# Altium schematic sheet MillingLight.SchDoc
size A3
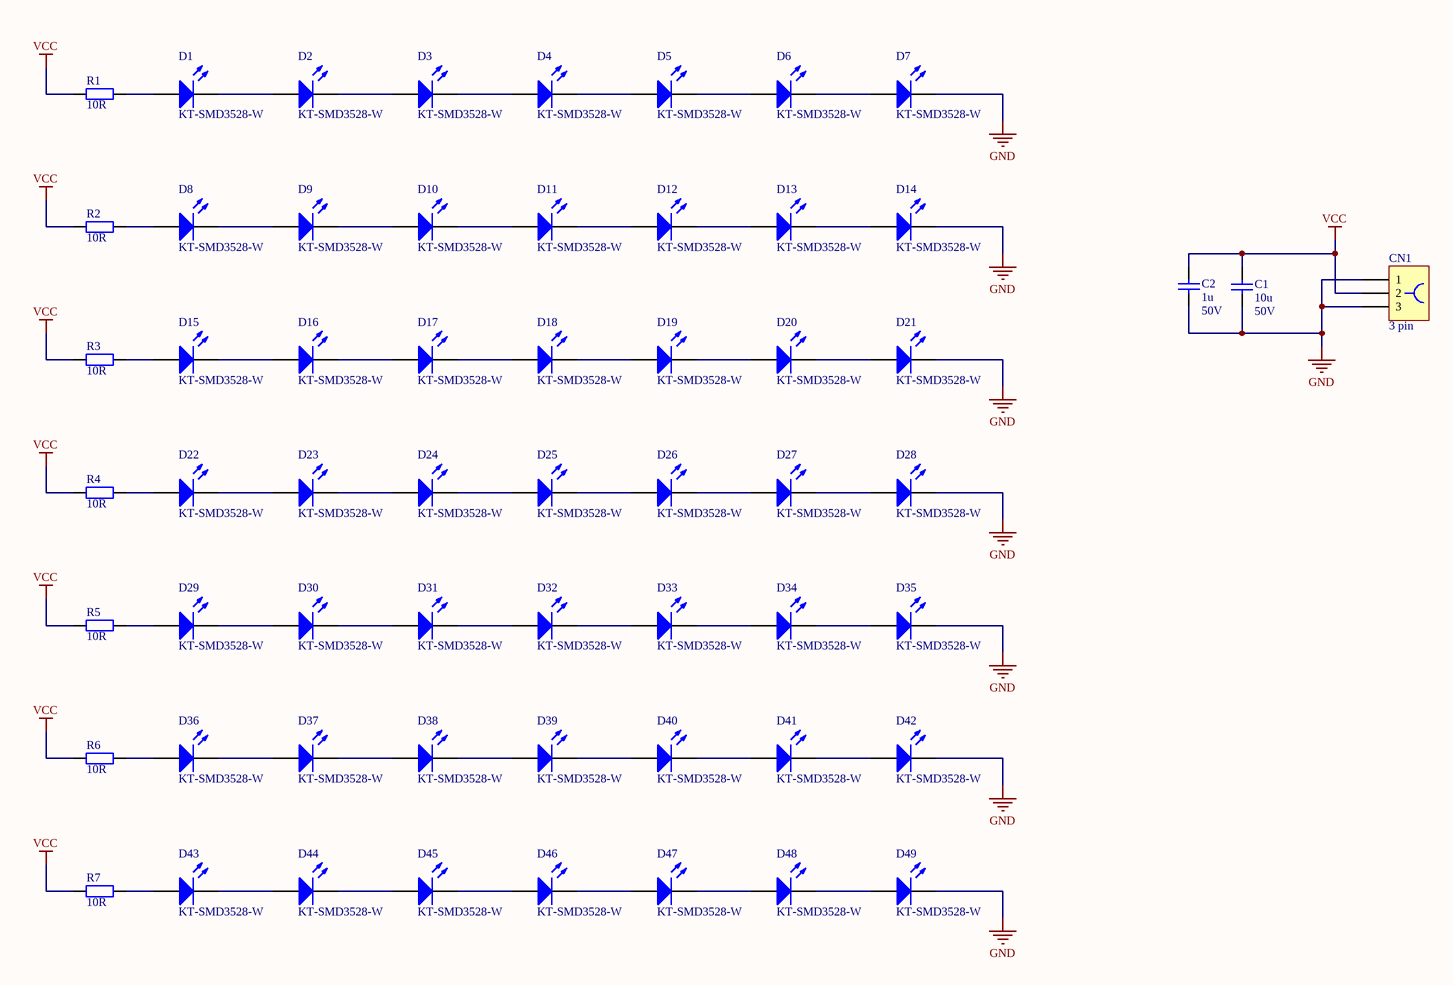
[diagram p0: MillingLight.SchDoc]

## Parts
C1  Value1: 10u  Value2: 50V  [CAPC3216X18N]  (hidden comment: CAP)
C2  Value1: 1u  Value2: 50V  [CAPC2012X125N]  (hidden comment: CAP)
CN1  Value1: 3 pin  [CN_WURTH_691216510003]  (hidden comment: CN_1X3F)
D1  Value1: KT-SMD3528-W  [DIO_Kento_KT-SMD3528-W]  (hidden comment: DIO_LED)
D2  Value1: KT-SMD3528-W  [DIO_Kento_KT-SMD3528-W]  (hidden comment: DIO_LED)
D3  Value1: KT-SMD3528-W  [DIO_Kento_KT-SMD3528-W]  (hidden comment: DIO_LED)
D4  Value1: KT-SMD3528-W  [DIO_Kento_KT-SMD3528-W]  (hidden comment: DIO_LED)
D5  Value1: KT-SMD3528-W  [DIO_Kento_KT-SMD3528-W]  (hidden comment: DIO_LED)
D6  Value1: KT-SMD3528-W  [DIO_Kento_KT-SMD3528-W]  (hidden comment: DIO_LED)
D7  Value1: KT-SMD3528-W  [DIO_Kento_KT-SMD3528-W]  (hidden comment: DIO_LED)
D8  Value1: KT-SMD3528-W  [DIO_Kento_KT-SMD3528-W]  (hidden comment: DIO_LED)
D9  Value1: KT-SMD3528-W  [DIO_Kento_KT-SMD3528-W]  (hidden comment: DIO_LED)
D10  Value1: KT-SMD3528-W  [DIO_Kento_KT-SMD3528-W]  (hidden comment: DIO_LED)
D11  Value1: KT-SMD3528-W  [DIO_Kento_KT-SMD3528-W]  (hidden comment: DIO_LED)
D12  Value1: KT-SMD3528-W  [DIO_Kento_KT-SMD3528-W]  (hidden comment: DIO_LED)
D13  Value1: KT-SMD3528-W  [DIO_Kento_KT-SMD3528-W]  (hidden comment: DIO_LED)
D14  Value1: KT-SMD3528-W  [DIO_Kento_KT-SMD3528-W]  (hidden comment: DIO_LED)
D15  Value1: KT-SMD3528-W  [DIO_Kento_KT-SMD3528-W]  (hidden comment: DIO_LED)
D16  Value1: KT-SMD3528-W  [DIO_Kento_KT-SMD3528-W]  (hidden comment: DIO_LED)
D17  Value1: KT-SMD3528-W  [DIO_Kento_KT-SMD3528-W]  (hidden comment: DIO_LED)
D18  Value1: KT-SMD3528-W  [DIO_Kento_KT-SMD3528-W]  (hidden comment: DIO_LED)
D19  Value1: KT-SMD3528-W  [DIO_Kento_KT-SMD3528-W]  (hidden comment: DIO_LED)
D20  Value1: KT-SMD3528-W  [DIO_Kento_KT-SMD3528-W]  (hidden comment: DIO_LED)
D21  Value1: KT-SMD3528-W  [DIO_Kento_KT-SMD3528-W]  (hidden comment: DIO_LED)
D22  Value1: KT-SMD3528-W  [DIO_Kento_KT-SMD3528-W]  (hidden comment: DIO_LED)
D23  Value1: KT-SMD3528-W  [DIO_Kento_KT-SMD3528-W]  (hidden comment: DIO_LED)
D24  Value1: KT-SMD3528-W  [DIO_Kento_KT-SMD3528-W]  (hidden comment: DIO_LED)
D25  Value1: KT-SMD3528-W  [DIO_Kento_KT-SMD3528-W]  (hidden comment: DIO_LED)
D26  Value1: KT-SMD3528-W  [DIO_Kento_KT-SMD3528-W]  (hidden comment: DIO_LED)
D27  Value1: KT-SMD3528-W  [DIO_Kento_KT-SMD3528-W]  (hidden comment: DIO_LED)
D28  Value1: KT-SMD3528-W  [DIO_Kento_KT-SMD3528-W]  (hidden comment: DIO_LED)
D29  Value1: KT-SMD3528-W  [DIO_Kento_KT-SMD3528-W]  (hidden comment: DIO_LED)
D30  Value1: KT-SMD3528-W  [DIO_Kento_KT-SMD3528-W]  (hidden comment: DIO_LED)
D31  Value1: KT-SMD3528-W  [DIO_Kento_KT-SMD3528-W]  (hidden comment: DIO_LED)
D32  Value1: KT-SMD3528-W  [DIO_Kento_KT-SMD3528-W]  (hidden comment: DIO_LED)
D33  Value1: KT-SMD3528-W  [DIO_Kento_KT-SMD3528-W]  (hidden comment: DIO_LED)
D34  Value1: KT-SMD3528-W  [DIO_Kento_KT-SMD3528-W]  (hidden comment: DIO_LED)
D35  Value1: KT-SMD3528-W  [DIO_Kento_KT-SMD3528-W]  (hidden comment: DIO_LED)
D36  Value1: KT-SMD3528-W  [DIO_Kento_KT-SMD3528-W]  (hidden comment: DIO_LED)
D37  Value1: KT-SMD3528-W  [DIO_Kento_KT-SMD3528-W]  (hidden comment: DIO_LED)
D38  Value1: KT-SMD3528-W  [DIO_Kento_KT-SMD3528-W]  (hidden comment: DIO_LED)
D39  Value1: KT-SMD3528-W  [DIO_Kento_KT-SMD3528-W]  (hidden comment: DIO_LED)
D40  Value1: KT-SMD3528-W  [DIO_Kento_KT-SMD3528-W]  (hidden comment: DIO_LED)
D41  Value1: KT-SMD3528-W  [DIO_Kento_KT-SMD3528-W]  (hidden comment: DIO_LED)
D42  Value1: KT-SMD3528-W  [DIO_Kento_KT-SMD3528-W]  (hidden comment: DIO_LED)
D43  Value1: KT-SMD3528-W  [DIO_Kento_KT-SMD3528-W]  (hidden comment: DIO_LED)
D44  Value1: KT-SMD3528-W  [DIO_Kento_KT-SMD3528-W]  (hidden comment: DIO_LED)
D45  Value1: KT-SMD3528-W  [DIO_Kento_KT-SMD3528-W]  (hidden comment: DIO_LED)
D46  Value1: KT-SMD3528-W  [DIO_Kento_KT-SMD3528-W]  (hidden comment: DIO_LED)
D47  Value1: KT-SMD3528-W  [DIO_Kento_KT-SMD3528-W]  (hidden comment: DIO_LED)
D48  Value1: KT-SMD3528-W  [DIO_Kento_KT-SMD3528-W]  (hidden comment: DIO_LED)
D49  Value1: KT-SMD3528-W  [DIO_Kento_KT-SMD3528-W]  (hidden comment: DIO_LED)
R1  Value1: 10R  [RESC2012X60N]  (hidden comment: RES)
R2  Value1: 10R  [RESC2012X60N]  (hidden comment: RES)
R3  Value1: 10R  [RESC2012X60N]  (hidden comment: RES)
R4  Value1: 10R  [RESC2012X60N]  (hidden comment: RES)
R5  Value1: 10R  [RESC2012X60N]  (hidden comment: RES)
R6  Value1: 10R  [RESC2012X60N]  (hidden comment: RES)
R7  Value1: 10R  [RESC2012X60N]  (hidden comment: RES)

## Nets
GND: C1.1 C2.1 CN1.1 CN1.3 D7.1(K) D14.1(K) D21.1(K) D28.1(K) D35.1(K) D42.1(K) D49.1(K)
VCC: C1.2 C2.2 CN1.2 R1.1 R2.1 R3.1 R4.1 R5.1 R6.1 R7.1
NetD1_1: D1.1(K) D2.2(A)
NetD1_2: D1.2(A) R1.2
NetD2_1: D2.1(K) D3.2(A)
NetD3_1: D3.1(K) D4.2(A)
NetD4_1: D4.1(K) D5.2(A)
NetD5_1: D5.1(K) D6.2(A)
NetD6_1: D6.1(K) D7.2(A)
NetD8_1: D8.1(K) D9.2(A)
NetD8_2: D8.2(A) R2.2
NetD9_1: D9.1(K) D10.2(A)
NetD10_1: D10.1(K) D11.2(A)
NetD11_1: D11.1(K) D12.2(A)
NetD12_1: D12.1(K) D13.2(A)
NetD13_1: D13.1(K) D14.2(A)
NetD15_1: D15.1(K) D16.2(A)
NetD15_2: D15.2(A) R3.2
NetD16_1: D16.1(K) D17.2(A)
NetD17_1: D17.1(K) D18.2(A)
NetD18_1: D18.1(K) D19.2(A)
NetD19_1: D19.1(K) D20.2(A)
NetD20_1: D20.1(K) D21.2(A)
NetD22_1: D22.1(K) D23.2(A)
NetD22_2: D22.2(A) R4.2
NetD23_1: D23.1(K) D24.2(A)
NetD24_1: D24.1(K) D25.2(A)
NetD25_1: D25.1(K) D26.2(A)
NetD26_1: D26.1(K) D27.2(A)
NetD27_1: D27.1(K) D28.2(A)
NetD29_1: D29.1(K) D30.2(A)
NetD29_2: D29.2(A) R5.2
NetD30_1: D30.1(K) D31.2(A)
NetD31_1: D31.1(K) D32.2(A)
NetD32_1: D32.1(K) D33.2(A)
NetD33_1: D33.1(K) D34.2(A)
NetD34_1: D34.1(K) D35.2(A)
NetD36_1: D36.1(K) D37.2(A)
NetD36_2: D36.2(A) R6.2
NetD37_1: D37.1(K) D38.2(A)
NetD38_1: D38.1(K) D39.2(A)
NetD39_1: D39.1(K) D40.2(A)
NetD40_1: D40.1(K) D41.2(A)
NetD41_1: D41.1(K) D42.2(A)
NetD43_1: D43.1(K) D44.2(A)
NetD43_2: D43.2(A) R7.2
NetD44_1: D44.1(K) D45.2(A)
NetD45_1: D45.1(K) D46.2(A)
NetD46_1: D46.1(K) D47.2(A)
NetD47_1: D47.1(K) D48.2(A)
NetD48_1: D48.1(K) D49.2(A)

## Library data of the parts
C1 = 01_01488: CAP, MLCC, X5R, 10UF, 50V, 1206; Manufacturer: Murata; Manufacturer PN: GRM31CR61H106KA12L; AutoId: 1488; DeviceType: capacitor; SubType: Ceramic; Id: 01_01488; Status: 0 - Unchecked; MountType: SMD; ComponentLink1URL: X:\01_dataSheets\CAP_MURATA_GRM.pdf; Supplier 1: Farnell; Supplier Part Number 1: 1845762; ComponentLink1Description: Datasheet
C2 = 01_01396: X7R 10% 0805; Manufacturer: KEMET; Manufacturer PN: C0805C105K5RACTU; AutoId: 1396; DeviceType: capacitor; SubType: Ceramic; Id: 01_01396; Status: 2 - Checked and Approved; MountType: SMT; ComponentLink1URL: X:\01_Datasheets\CAP_KEMET_CxxxxCxxxXxRAC.pdf; Supplier 1: Farnell; Supplier Part Number 1: 2118131; ComponentLink1Description: Datasheet
CN1 = 02_00091: WURTH ELEKTRONIK 691216510003 - T/BLOCK, 5,08mm 3W; AutoId: 91; DeviceType: Connector_3; Id: 02_00091; Manufacturer: Wurth; Manufacturer PN: 691216510003; Status: 0 - Unchecked; MountType: THT; ComponentLink1Description: Datasheet; ComponentLink1URL: X:\01_dataSheets\CN_WURTH_69121651000x.pdf; ComponentLink2Description: ComponentVerificationSheet; ComponentLink2URL: X:\02_ComponentVerificationSheets\; Supplier 1: Farnell; Supplier Part Number 1: 1841253
D1-D49 = 03_00093: High Luminous PLCC2 Power Top SMD LED; Manufacturer: Kento; AutoId: 109; Value2: 2,8..3,5V  2000...2200 mcd; DeviceType: diode; Id: 03_00093; Value3: LED; Manufacturer PN: KT-SMD3528-W; SubType: LED; Status: 0 - Unchecked; MountType: SMD; ComponentLink1Description: Datasheet; ComponentLink1URL: X:\01_Datasheets\; ComponentLink2Description: ComponentVerificationSheet; ComponentLink2URL: X:\02_ComponentVerificationSheets\; Supplier 1: rcs; Supplier Part Number 1: 86399
R1-R7 = 15_00305: RESISTOR, 0805, 10R, 1%, SMD; Manufacturer: Yageo; Manufacturer PN: RC0805FR-0710R; AutoId: 305; Value2: 0W125; SubType: Metal film; Id: 15_00305; DeviceType: resistor; Status: 0 - Unchecked; MountType: SMT; ComponentLink1Description: Datasheet; ComponentLink1URL: X:\01_Datasheets\RES_YAGEO_RC0805FR.pdf; Supplier 1: Farnell